# EAGLE design bateria (EAGLE 7.7.0)
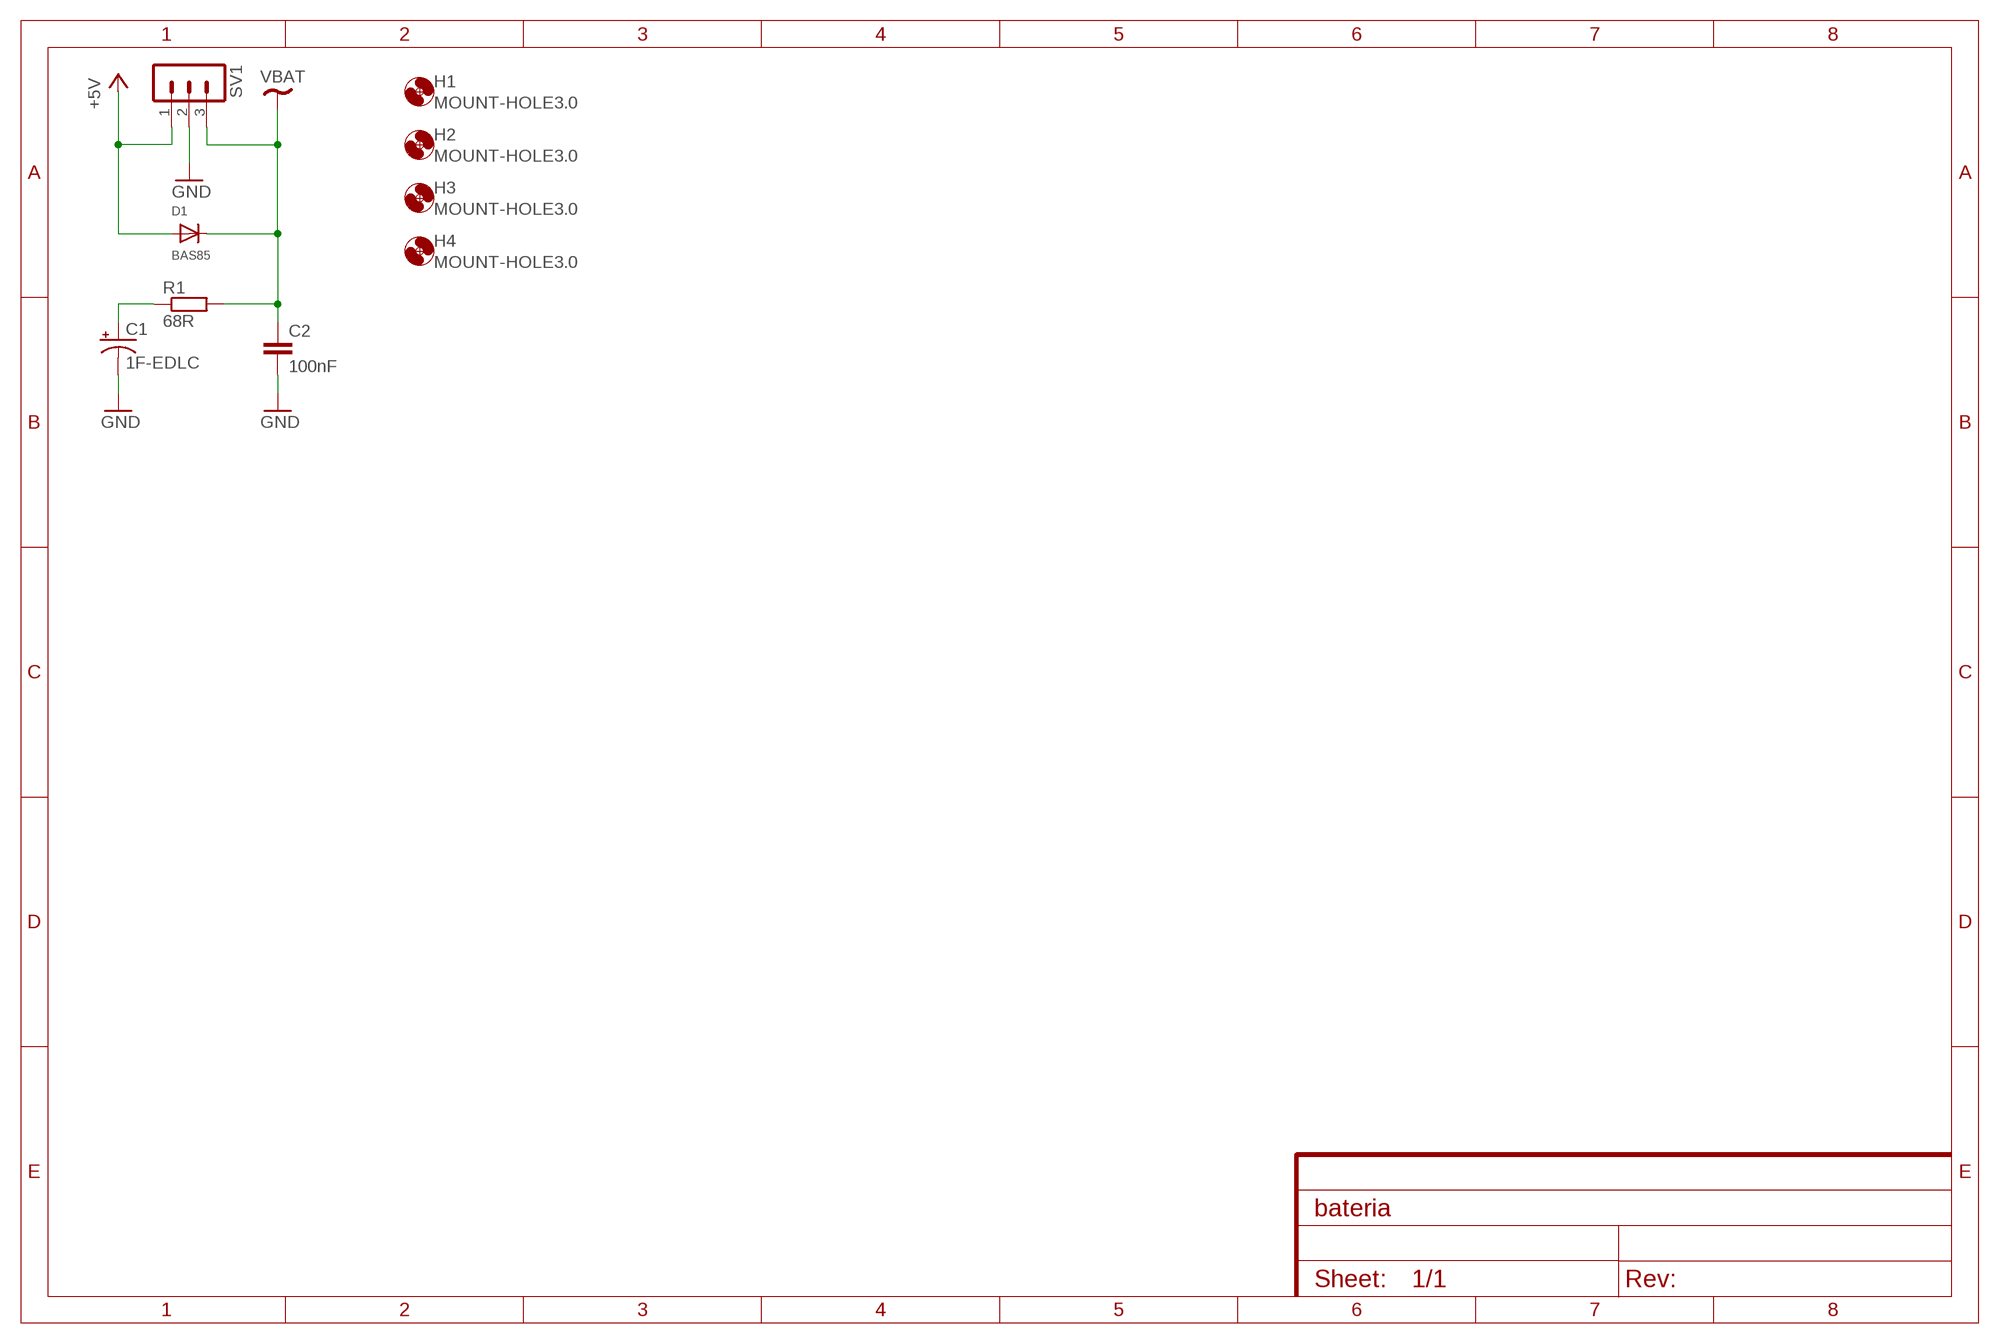
[diagram p0: schematic, sheet 1]

## Parts
C1  1F-EDLC  [CAP-RADIAL-5MM-21.5MM]
C2  100nF  C-EUC0805  [C0805]
D1  BAS85  DIODESMA  [SMADIODE]
H1  MOUNT-HOLE3.0  [3,0]
H2  MOUNT-HOLE3.0  [3,0]
H3  MOUNT-HOLE3.0  [3,0]
H4  MOUNT-HOLE3.0  [3,0]
R1  68R  R-EU_R0805  [R0805]
SV1  MA03-1  [MA03-1]

## Nets
+5V: D1.A SV1.1
GND: C1.- C2.2 SV1.2
N$1: C1.+ R1.1
VBAT: C2.1 D1.C R1.2 SV1.3

## Library data of the parts
C1 = SparkFun-Capacitors:1F-EDLC: [Eaton] [KR-5R5C105-R] - [1F Electric Double Layer Capacitor (SuperCapacitor)] This is a 21.5mm OD 1F SuperCapacitor.; PROD_ID: CAP-13904
C2 = rcl:C-EU: CAPACITOR, European symbol
D1 = adafruit:DIODE: Diode SMADIODE - SMA Surface Mount Package 20V 1A Schottky Diode Digikey: 641-1014-6-ND DO-1N4148 - Through Hole Small Current Diode SOD-123 20V 1 A (.5mV Vf) Schottky Diode - Digikey: MBRX120TPMSCT-ND SOD-323 10V 570mA (.38mV Vf, 3ns) Schottky Diode - Digikey: ZLLS410CT-ND SOD-523 30V 30mA Schottky Diode (RB751S-40TE61) - Digikey: RB751S-40TE61CT-ND SOT23-R/W - SOT23 Package (R = Solder Paste/Reflow Ovens, W = Hand-Soldering) BAT54Film 40V 300mA - Digikey: 497-7162-1-ND
H1-H4 = holes:MOUNT-HOLE: MOUNTING HOLE with drill center marker
R1 = rcl:R-EU_: RESISTOR, European symbol
SV1 = con-lstb:MA03-1: PIN HEADER; OC_FARNELL: unknown; OC_NEWARK: unknown

## Board
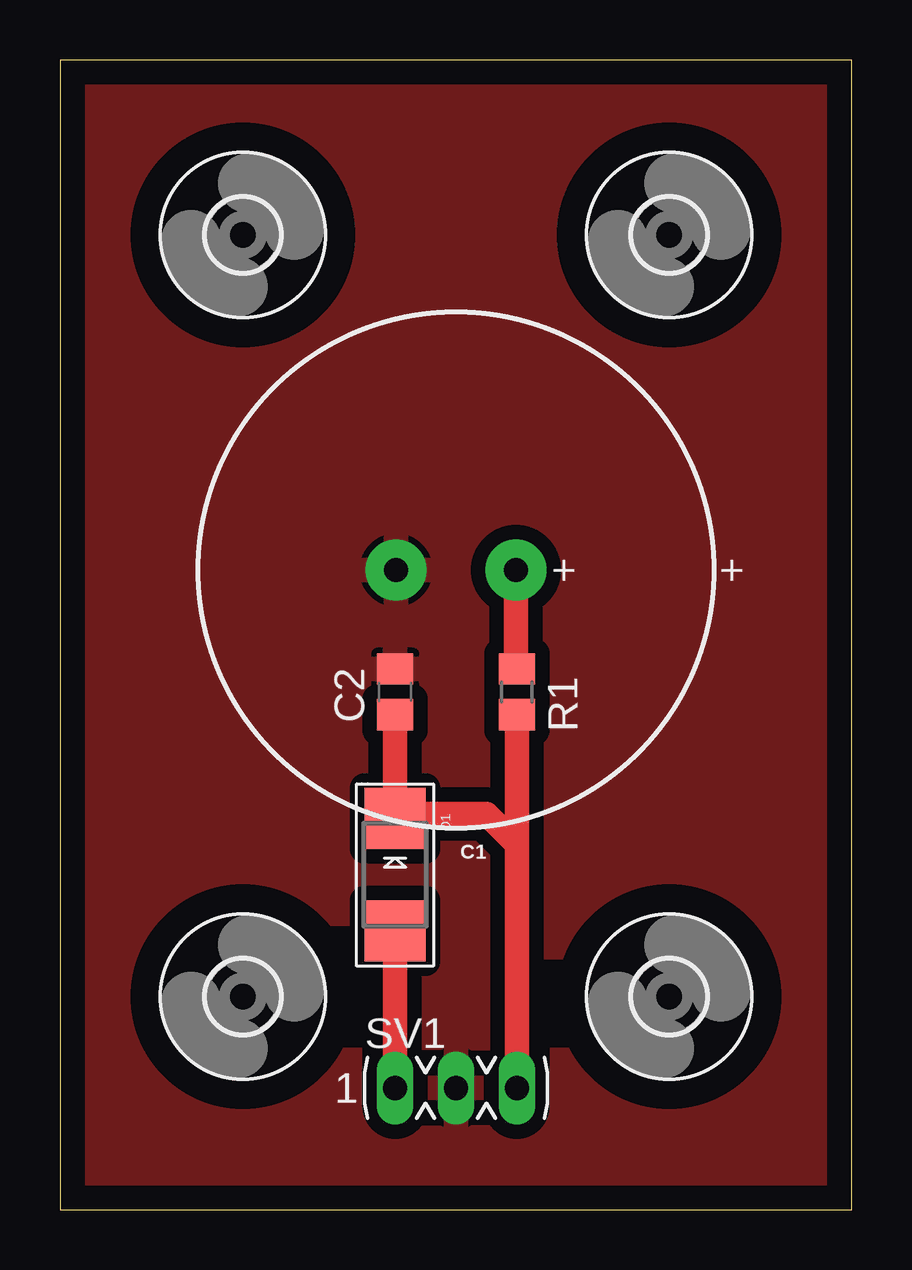
[diagram p1: board, top side]

Size 33 x 47.93 mm. Coordinates in mm from the lower left corner, seen from the top.
Outline: 0,0 33,0 33,47.93 0,47.93 0,0
Copper layers (1*16): Top 0.035mm / dielectric 1.5mm / Bottom 0.035mm
Design rules "default": minimum track width 10mil, minimum drill 24mil, track to track 8mil, track to pad 8mil, pad to pad 8mil, via to via 8mil, smd to smd 8mil, copper to edge 40mil, drill to drill 8mil, minimum pad ring 10mil, minimum via ring 8mil, stop-mask expansion 4mil, vias tented up to drill 0mil, thermal gap 10mil

### Footprints (pad centres in the part's own frame; a part is rotated, then mirrored left to right if it is on the bottom)
CAP-RADIAL-5MM-21.5MM = drill 1 pad 2.54: + -2.5,0; - 2.5,0
C0805 = smd 1.3 x 1.5: 1 -0.95,0; 2 0.95,0
SMADIODE = smd 2.54 x 2.54: A 2.349,0; C -2.349,0
3,0 = hole 3: 0,0
R0805 = smd 1.3 x 1.5: 1 -0.95,0; 2 0.95,0
MA03-1 = drill 1.016 long: 1 -2.54,0; 2 0,0; 3 2.54,0

### Placement (x,y rotation side)
C1  16.51,26.67 180 top
C2  13.97,21.59 90 top
D1  13.97,13.97 270 top
H1  7.62,8.89 0 top
H2  25.4,8.89 0 top
H3  7.62,40.64 0 top
H4  25.4,40.64 0 top
R1  19.05,21.59 270 top
SV1  16.51,5.08 0 top

### Tracks (layer width: path | path; a pad name or v marks a point on that pad's centre or on a via)
+5V
  Top 1.016: SV1.1 D1.A
GND
  pour Top (isolate 0.61): 0,0 0,46.99 33.02,46.99 33.02,0
N$1
  Top 1.016: C1.+ 19.01,22.58 R1.1
VBAT
  Top 1.016: SV1.3 19.05,15.24 | 19.05,15.24 17.78,16.51 14.16,16.51 D1.C C2.1 | R1.2 19.05,15.24